# Altium schematic sheet Power_Input.SchDoc: Power input
size A4; SheetNumber: 2
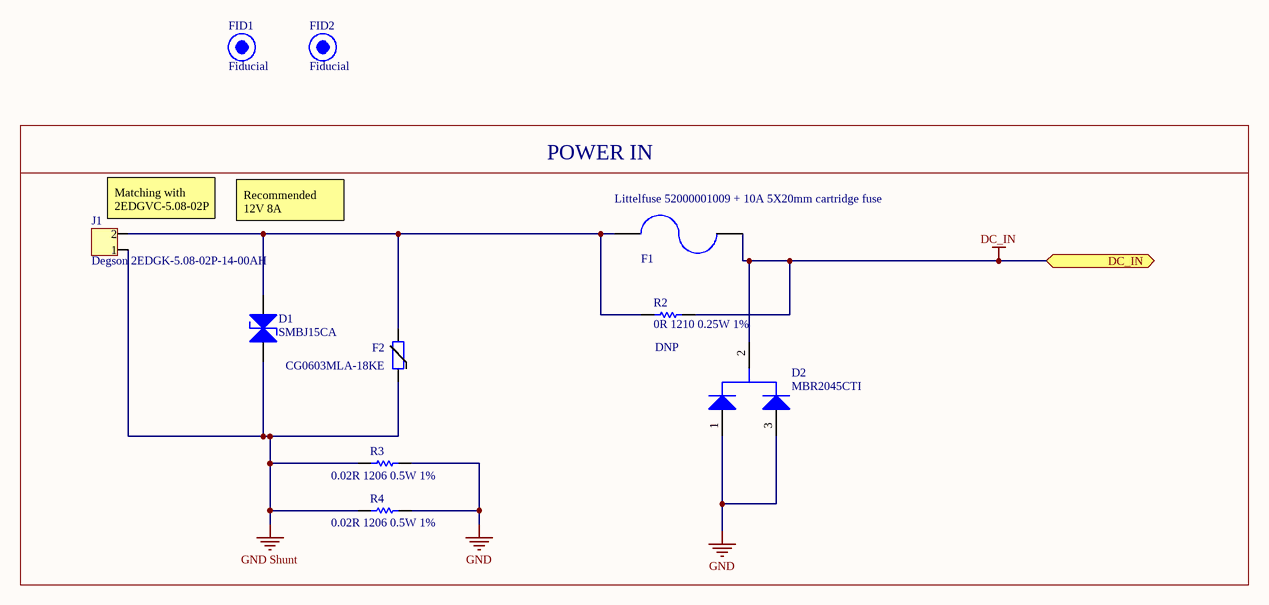
[diagram p0: Power_Input.SchDoc]

## Parts
D1  SMBJ15CA  [PCB-acsqsz06h0bi34fqghyj-1]
D2  MBR2045CTI  [INF-PG-TO251-3-11]
F1  Littelfuse 52000001009 + 10A 5X20mm cartridge fuse  [PCB-ute3syh1w8vttzwbvd5x-1]
F2  CG0603MLA-18KE  [CAPC1608X60X35NL10T15]
FID1  Fiducial  [PCB-4cof372i0ax01akz57r7-1]
FID2  Fiducial  [PCB-4cof372i0ax01akz57r7-1]
J1  Degson 2EDGK-5.08-02P-14-00AH  [PCB-h4cyb3wxd4gf7j132tzl-1]
R2  0R 1210 0.25W 1%  [RESC3225X70X50NL20T20]  (no BOM)
R3  0.02R 1206 0.5W 1%  [CAPC3216X180X55ML20T25]
R4  0.02R 1206 0.5W 1%  [CAPC3216X180X55ML20T25]

## Blocks framed on the sheet
POWER IN: D1 D2 F1 F2 J1 R2-R4

## Ports
DC_IN

## Nets
DC_IN: D2.2(K) F1.2 R2.2 ; port DC_IN
GND: D2.1(A1) D2.3(A2) R3.1 R4.1
GND Shunt: D1.1(A) F2.1 J1.1 R3.2 R4.2
NetD1_2: D1.2(K) F1.1 F2.2 J1.2 R2.1

## Notes on the sheet
- (near J1) Matching with 2EDGVC-5.08-02P
- Recommended 12V 8A (minimum)
- Title
- Size:
- Date:
- A3
- Author:
- Time:
- Revision:
- Sheet
- of
- File:

## Library data of the parts
D1 = CMP-f09b39914f642f5c-1: SMBJ15 Series 24.4 V 600 W Bi-Directional Transient Voltage Suppressor-DO-214AA; Power Dissipation: 5.00 W; Breakdown Voltage: 16.7 V; Power Rating: 600 W; Octopart URL: http://octopart.com/smbj15ca-littelfuse-39577; Mounting Style: Surface Mount; RoHS: Compliant
D2 = CMP-d2061815e9930dc1-1: Schottky Rectifier TO251 Tube 75PCS; Manufacturer Part Number: MBR2045CTI; Mounting Style: Through Hole; OctopartID: d2061815e9930dc1; Lifecycle Status: Not Listed by Manufacturer
F1 = CMP-e4812c024ed53b46-3: Fuse Clip with Ear Through Hole Bulk + 10A 5X20mm cartridge fuse; Manufacturer Part Number: FC-201BRIGHTTIN; RoHS: Compliant; OctopartID: e4812c024ed53b46; Mounting Style: Through Hole; Packaging: Bag
F2 = CMP-c3730a7940881cb4-1: Var MOV 14VAC 18VDC 30A 24.2V 0603 SMD Paper T/R Var MOV 14VAC 18VDC 30A 24.2V 0603 SMD Paper T/R; Capacitance: 140 pF; Operating Voltage: 14.0 V; Voltage Rating (DC): 18.0 V; Octopart URL: https://octopart.com/cg0603mla-18ke-bourns-42653; Manufacturer Part Number: CG0603MLA-18KE; Case/Package: 0603; Mounting Style: Surface Mount, Solder; Operating Temperature: -55.0 °C (min); Packaging: Reel; REACH SVHC Compliance: No SVHC; RoHS: Compliant; Size-Height: 813 µm; Size-Length: 1.63 mm; Size-Width: 813 µm; Voltage Rating (AC): 14.0 V; OctopartID: c3730a7940881cb4
FID1 FID2 = CMP-4cof372i0ax01akz57r7-6
J1 = CMP-7a42b7ee166ba585-1: Terminal block, 5mm 2 Pos, through hole male.; Octopart URL: https://octopart.com/2edgk-5.08-02p-14-00ah-degson-78006607; Manufacturer Part Number: 2EDGK-5.08-02P-14-00AH; OctopartID: 7a42b7ee166ba585
R2 = CMP-2532823-2: Case/Package: 1210; DNP: DNP
R3 R4 = CMP-0abdc173b10ad57a-1: Manufacturer Part Number: 1-2176055-0; Resistance: 0,024; Power: 1/2W; Octopart URL: https://octopart.com/1-2176055-0-te+connectivity-46440145; Case/Package: 1206; Lifecycle Status: Not Listed by Manufacturer; Packaging: Tape & Reel (TR); OctopartID: 0abdc173b10ad57a